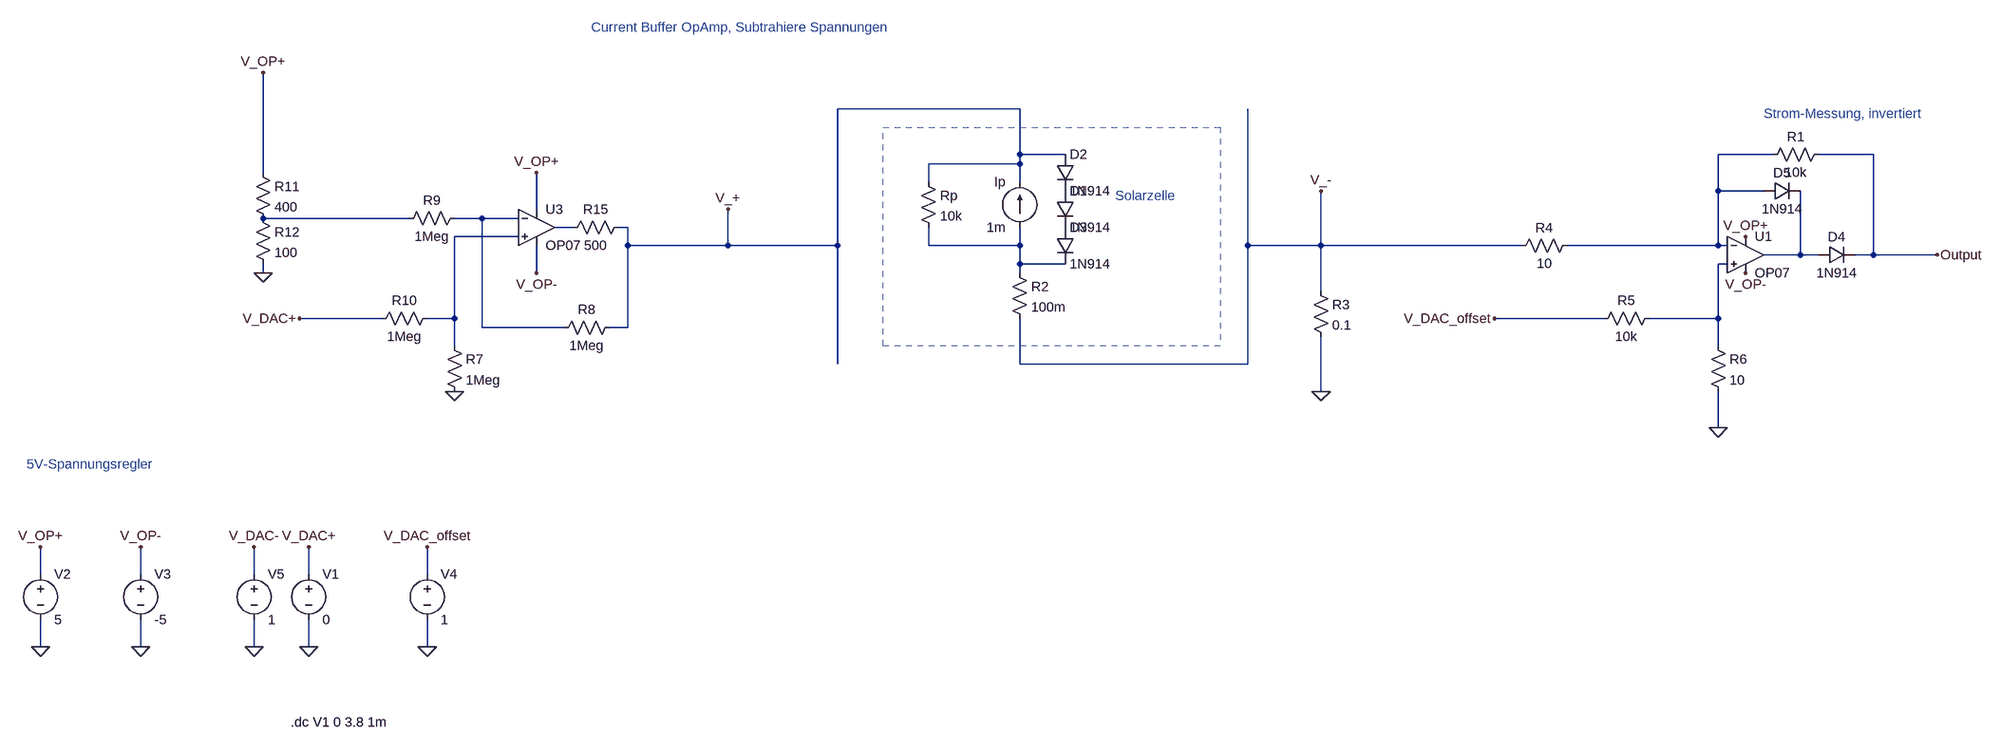
[diagram p0: schematic 20220823_Sim.asc]
20220823_Sim.asc, the LTspice schematic file:
Version 4
SHEET 1 2292 956
WIRE 272 -304 -48 -304
WIRE 272 -224 272 -304
WIRE 352 -224 272 -224
WIRE 1696 -224 1600 -224
WIRE 1872 -224 1776 -224
WIRE 272 -208 272 -224
WIRE 272 -208 112 -208
WIRE -1056 -192 -1056 -368
WIRE 112 -176 112 -208
WIRE 272 -176 272 -208
WIRE 1600 -160 1600 -224
WIRE 1680 -160 1600 -160
WIRE -576 -128 -576 -192
WIRE -800 -112 -1056 -112
WIRE -672 -112 -720 -112
WIRE -608 -112 -672 -112
WIRE -512 -96 -544 -96
WIRE -416 -96 -432 -96
WIRE -608 -80 -720 -80
WIRE -416 -64 -416 -96
WIRE -240 -64 -240 -128
WIRE -240 -64 -416 -64
WIRE -48 -64 -48 -304
WIRE -48 -64 -240 -64
WIRE 112 -64 112 -96
WIRE 272 -64 272 -96
WIRE 272 -64 112 -64
WIRE 672 -64 672 -304
WIRE 896 -64 896 -160
WIRE 896 -64 672 -64
WIRE 1248 -64 896 -64
WIRE 1600 -64 1600 -160
WIRE 1600 -64 1328 -64
WIRE 1616 -64 1600 -64
WIRE 1744 -48 1744 -160
WIRE 1744 -48 1680 -48
WIRE 1776 -48 1744 -48
WIRE 1872 -48 1872 -224
WIRE 1872 -48 1840 -48
WIRE 1984 -48 1872 -48
WIRE 272 -32 272 -64
WIRE 352 -32 272 -32
WIRE 1616 -32 1600 -32
WIRE -1056 -16 -1056 -32
WIRE -576 -16 -576 -64
WIRE 272 -16 272 -32
WIRE 896 16 896 -64
WIRE -848 64 -992 64
WIRE -720 64 -720 -80
WIRE -720 64 -768 64
WIRE 1392 64 1200 64
WIRE 1600 64 1600 -32
WIRE 1600 64 1472 64
WIRE -672 80 -672 -112
WIRE -528 80 -672 80
WIRE -416 80 -416 -64
WIRE -416 80 -448 80
WIRE -720 112 -720 64
WIRE 1600 112 1600 64
WIRE -48 144 -48 -64
WIRE 272 144 272 64
WIRE 672 144 672 -64
WIRE 672 144 272 144
WIRE 896 192 896 96
WIRE 1600 256 1600 192
WIRE -1632 528 -1632 480
WIRE -1456 528 -1456 480
WIRE -1072 528 -1072 480
WIRE -976 528 -976 480
WIRE -768 528 -768 480
WIRE -1632 656 -1632 608
WIRE -1456 656 -1456 608
WIRE -1072 656 -1072 608
WIRE -976 656 -976 608
WIRE -768 656 -768 608
FLAG 896 192 0
FLAG 896 -160 V_-
FLAG -976 480 V_DAC+
FLAG -976 656 0
FLAG -1456 656 0
FLAG -1632 656 0
FLAG -1632 480 V_OP+
FLAG -1456 480 V_OP-
FLAG 1648 -80 V_OP+
FLAG 1648 -16 V_OP-
FLAG 1984 -48 Output
FLAG 1600 256 0
FLAG -576 -16 V_OP-
FLAG -576 -192 V_OP+
FLAG -240 -128 V_+
FLAG -768 480 V_DAC_offset
FLAG -768 656 0
FLAG 1200 64 V_DAC_offset
FLAG -1072 480 V_DAC-
FLAG -1072 656 0
FLAG -992 64 V_DAC+
FLAG -720 192 0
FLAG -1056 -16 0
FLAG -1056 -368 V_OP+
SYMBOL diode 336 -160 R0
SYMATTR InstName D1
SYMATTR Value 1N914
SYMBOL res 96 -192 R0
SYMATTR InstName Rp
SYMATTR Value 10k
SYMBOL res 256 -32 R0
SYMATTR InstName R2
SYMATTR Value 100m
SYMBOL current 272 -96 R180
WINDOW 0 24 80 Left 2
WINDOW 3 24 0 Left 2
WINDOW 123 0 0 Left 0
WINDOW 39 0 0 Left 0
SYMATTR InstName Ip
SYMATTR Value 1m
SYMBOL res 880 0 R0
SYMATTR InstName R3
SYMATTR Value 0.1
SYMBOL voltage -976 512 R0
WINDOW 123 0 0 Left 0
WINDOW 39 0 0 Left 0
SYMATTR InstName V1
SYMATTR Value 0
SYMBOL OpAmps\\OP07 1648 -112 R0
SYMATTR InstName U1
SYMBOL voltage -1632 512 R0
WINDOW 123 0 0 Left 0
WINDOW 39 0 0 Left 0
SYMATTR InstName V2
SYMATTR Value 5
SYMBOL voltage -1456 512 R0
WINDOW 123 0 0 Left 0
WINDOW 39 0 0 Left 0
SYMATTR InstName V3
SYMATTR Value -5
SYMBOL res 1792 -240 R90
WINDOW 0 0 56 VBottom 2
WINDOW 3 32 56 VTop 2
SYMATTR InstName R1
SYMATTR Value 10k
SYMBOL res 1232 -48 R270
WINDOW 0 32 56 VTop 2
WINDOW 3 0 56 VBottom 2
SYMATTR InstName R4
SYMATTR Value 10
SYMBOL voltage -768 512 R0
WINDOW 123 0 0 Left 0
WINDOW 39 0 0 Left 0
SYMATTR InstName V4
SYMATTR Value 1
SYMBOL res -736 96 R0
SYMATTR InstName R7
SYMATTR Value 1Meg
SYMBOL res -432 64 R90
WINDOW 0 0 56 VBottom 2
WINDOW 3 32 56 VTop 2
SYMATTR InstName R8
SYMATTR Value 1Meg
SYMBOL res -704 -128 R90
WINDOW 0 0 56 VBottom 2
WINDOW 3 32 56 VTop 2
SYMATTR InstName R9
SYMATTR Value 1Meg
SYMBOL res -752 48 R90
WINDOW 0 0 56 VBottom 2
WINDOW 3 32 56 VTop 2
SYMATTR InstName R10
SYMATTR Value 1Meg
SYMBOL voltage -1072 512 R0
WINDOW 123 0 0 Left 0
WINDOW 39 0 0 Left 0
SYMATTR InstName V5
SYMATTR Value 1
SYMBOL res -1072 -208 R0
SYMATTR InstName R11
SYMATTR Value 400
SYMBOL res -1072 -128 R0
SYMATTR InstName R12
SYMATTR Value 100
SYMBOL OpAmps\\OP07 -576 -160 R0
SYMATTR InstName U3
SYMBOL diode 336 -224 R0
SYMATTR InstName D2
SYMATTR Value 1N914
SYMBOL diode 336 -96 R0
SYMATTR InstName D3
SYMATTR Value 1N914
SYMBOL res -416 -112 R90
WINDOW 0 0 56 VBottom 2
WINDOW 3 32 56 VTop 2
SYMATTR InstName R15
SYMATTR Value 500
SYMBOL diode 1776 -32 R270
WINDOW 0 32 32 VTop 2
WINDOW 3 0 32 VBottom 2
SYMATTR InstName D4
SYMATTR Value 1N914
SYMBOL diode 1680 -144 R270
WINDOW 0 32 32 VTop 2
WINDOW 3 0 32 VBottom 2
SYMATTR InstName D5
SYMATTR Value 1N914
SYMBOL res 1488 48 R90
WINDOW 0 0 56 VBottom 2
WINDOW 3 32 56 VTop 2
SYMATTR InstName R5
SYMATTR Value 10k
SYMBOL res 1584 96 R0
SYMATTR InstName R6
SYMATTR Value 10
TEXT -1008 888 Left 2 !.dc V1 0 3.8 1m
TEXT 440 -152 Left 2 ;Solarzelle
TEXT 1680 -296 Left 2 ;Strom-Messung, invertiert
TEXT -480 -448 Left 2 ;Current Buffer OpAmp, Subtrahiere Spannungen
TEXT -1656 320 Left 2 ;5V-Spannungsregler
RECTANGLE Normal 624 112 32 -272 2

The netlist it stands for:
* 20220823_Sim.asc
D1 P001 P002 1N914
Rp V_+ N006 10k
R2 N006 V_- 100m
Ip N006 V_+ 1m
R3 V_- 0 0.1
V1 V_DAC+ 0 0
XU1 N008 N001 V_OP+ V_OP- N007 LT1001  ; OP07, pins In+ In- V+ V- OUT
V2 V_OP+ 0 5
V3 V_OP- 0 -5
R1 Output N001 10k
R4 V_- N001 10
V4 V_DAC_offset 0 1
R7 N005 0 1Meg
R8 V_+ N003 1Meg
R9 N003 N002 1Meg
R10 N005 V_DAC+ 1Meg
V5 V_DAC- 0 1
R11 V_OP+ N002 400
R12 N002 0 100
XU3 N005 N003 V_OP+ V_OP- N004 LT1001  ; OP07, pins In+ In- V+ V- OUT
D2 V_+ P001 1N914
D3 P002 N006 1N914
R15 V_+ N004 500
D4 N007 Output 1N914
D5 N001 N007 1N914
R5 N008 V_DAC_offset 10k
R6 N008 0 10
.model D D
.lib standard.dio
.dc V1 0 3.8 1m
* Solarzelle
* Strom-Messung, invertiert
* Current Buffer OpAmp, Subtrahiere Spannungen
* 5V-Spannungsregler
.lib LTC.lib
.backanno
.end